# EAGLE design ATSAM_stepper_no_header_USART1 (EAGLE 9.1.0)
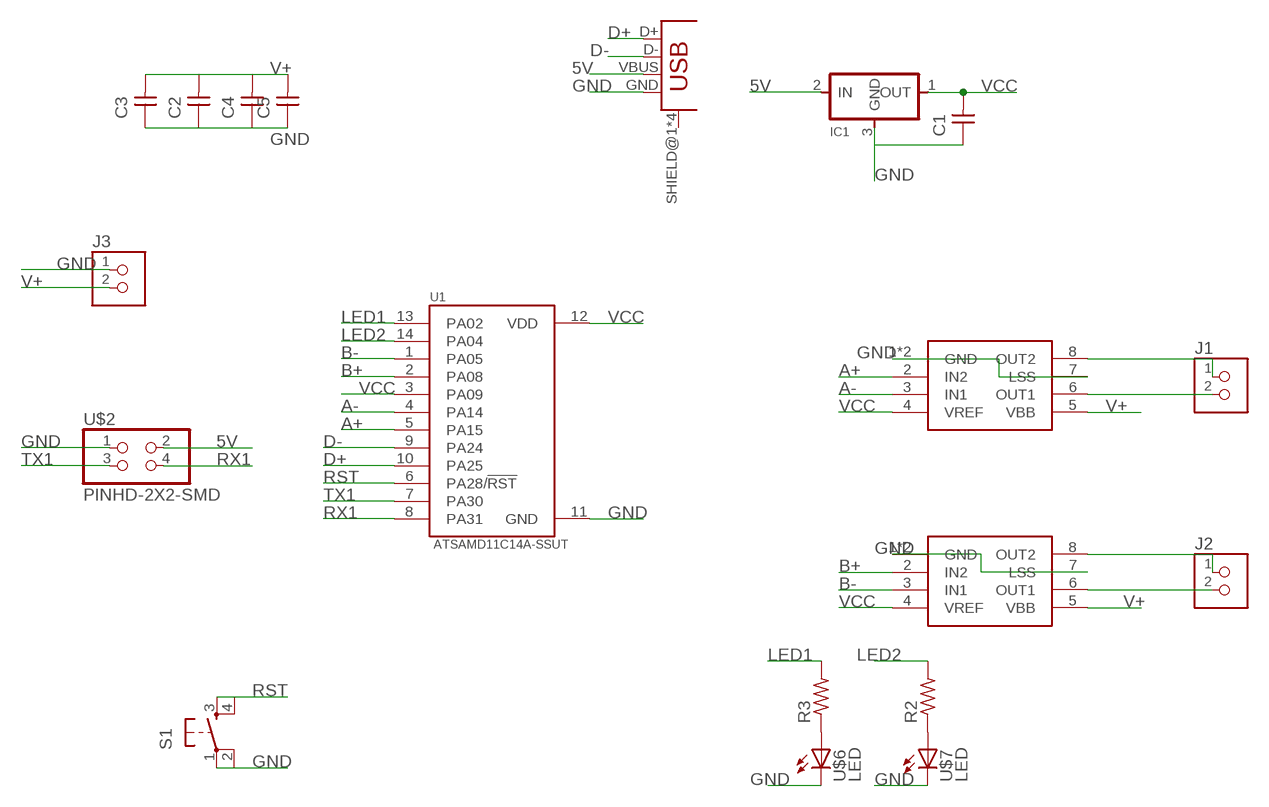
[diagram p0: schematic, sheet 1]

## Parts
C1  CAP-UNPOLARIZED  [C1206]
C2  CAP-UNPOLARIZED  [C1206]
C3  CAP-UNPOLARIZED  [C1206]
C4  CAP-UNPOLARIZED  [C1206]
C5  CAP-UNPOLARIZED  [C1206]
IC1  VR_REGULATOR-SOT23SOT23  [SOT23]
J1  TERM-1X02-FABLAB  [ED555DS-2DS]
J2  TERM-1X02-FABLAB  [ED555DS-2DS]
J3  TERM-1X02-FABLAB  [ED555DS-2DS]
R2  RES-US1206  [R1206]
R3  RES-US1206  [R1206]
S1  SW_SWITCH_TACTILE_6MM6MM_SWITCH  [6MM_SWITCH]
U1  ATSAMD11C14A-SSUT  [SOIC127P600X160-14N]
U$1  CONN_USB_MINIB  [USB_MINIB]
U$2  PINHD-2X2-SMD  [2X02SMD]
U$3  A4953-H-BRIDGE-MOTOR-DRIVER-PAD  [SOIC8_PAD]
U$4  A4953-H-BRIDGE-MOTOR-DRIVER-PAD  [SOIC8_PAD]
U$6  LED  [LED1206]
U$7  LED  [LED1206]

## Nets
5V: IC1.2(IN) U$1.VBUS U$2.2
A+: U1.5(PA15) U$3.2(IN2)
A-: U1.4(PA14) U$3.3(IN1)
B+: U1.2(PA08) U$4.2(IN2)
B-: U1.1(PA05) U$4.3(IN1)
D+: U1.10(PA25) U$1.D+
D-: U1.9(PA24) U$1.D-
GND: C1.1 C2.1 C3.1 C4.1 C5.1 IC1.3(GND) J3.1 S1.1(P) S1.2(P1) U1.11(GND) U$1.GND U$2.1 U$3.1(GND) U$3.7(LSS) U$3.GND U$4.1(GND) U$4.7(LSS) U$4.GND U$6.2(C) U$7.2(C)
LED1: R3.2 U1.13(PA02)
LED2: R2.2 U1.14(PA04)
N$5: R2.1 U$7.1(A)
N$12: J1.1 U$3.8(OUT2)
N$13: J1.2 U$3.6(OUT1)
N$14: J2.1 U$4.8(OUT2)
N$15: J2.2 U$4.6(OUT1)
N$16: R3.1 U$6.1(A)
RST: S1.3(S) S1.4(S1) U1.6(PA28/!RST)
RX1: U1.8(PA31) U$2.4
TX1: U1.7(PA30) U$2.3
V+: C2.2 C3.2 C4.2 C5.2 J3.2 U$3.5(VBB) U$4.5(VBB)
VCC: C1.2 IC1.1(OUT) U1.3(PA09) U1.12(VDD) U$3.4(VREF) U$4.4(VREF)
Unconnected: U$1.SHIELD@1(SHIELD) U$1.SHIELD@2(SHIELD) U$1.SHIELD@3(SHIELD) U$1.SHIELD@4(SHIELD)

## Library data of the parts
C1-C5 = fab:CAP-UNPOLARIZED
IC1 = fab:VR_REGULATOR-SOT23
J1-J3 = fab:TERM-1X02: 3.5mm terminal block, 2 positions ED555-2DS as found in the fablab inventory. Stolen from Adafruit <http://www.ladyada.net/library/pcb/eaglelibrary.html>, adapted by Zaerc.
R2 R3 = fab:RES-US: Resistor (US Symbol) Variants with postfix FAB are widened to allow the routing of internal traces
S1 = fab:SW_SWITCH_TACTILE_6MM: OMRON SWITCH
U1 = ATSAMD11C14A-SSUT:ATSAMD11C14A-SSUT: MCU 32-Bit SAM D11 ARM Cortex M0+ RISC 16KB Flash 1.8V/2.5V/3.3V 14-Pin SOIC T/R; AVAILABILITY: Unavailable; DESCRIPTION: Cortex-M0+, 16KB FLASH, 4KB SRAM, USB - 14 SOIC, INDUSTRIAL, GREEN, 1.6-3.6V, 48MHz/ SOIC .150 _SS_; MF: Microchip; MP: ATSAMD11C14A-SSUT; PACKAGE: SOIC-14 Microchip; PRICE: None
U$1 = fab:CONN_USB_MINIB
U$2 = fab:PINHD-2X2-SMD
U$3 U$4 = fab:A4953-H-BRIDGE-MOTOR-DRIVER-PAD
U$6 U$7 = fab:LED: LED

## Board
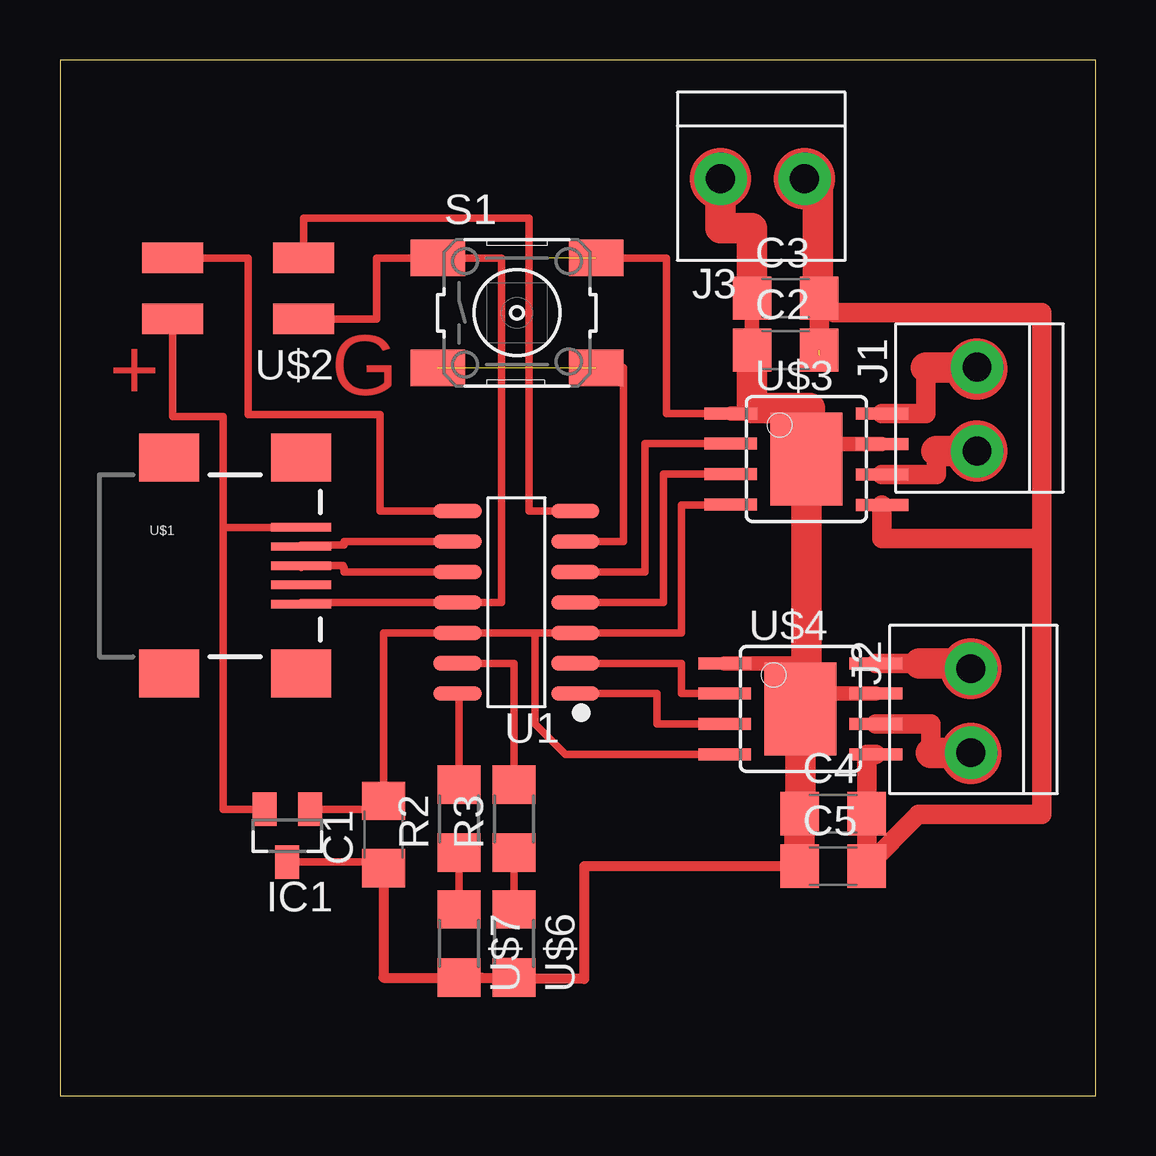
[diagram p1: board, top side]
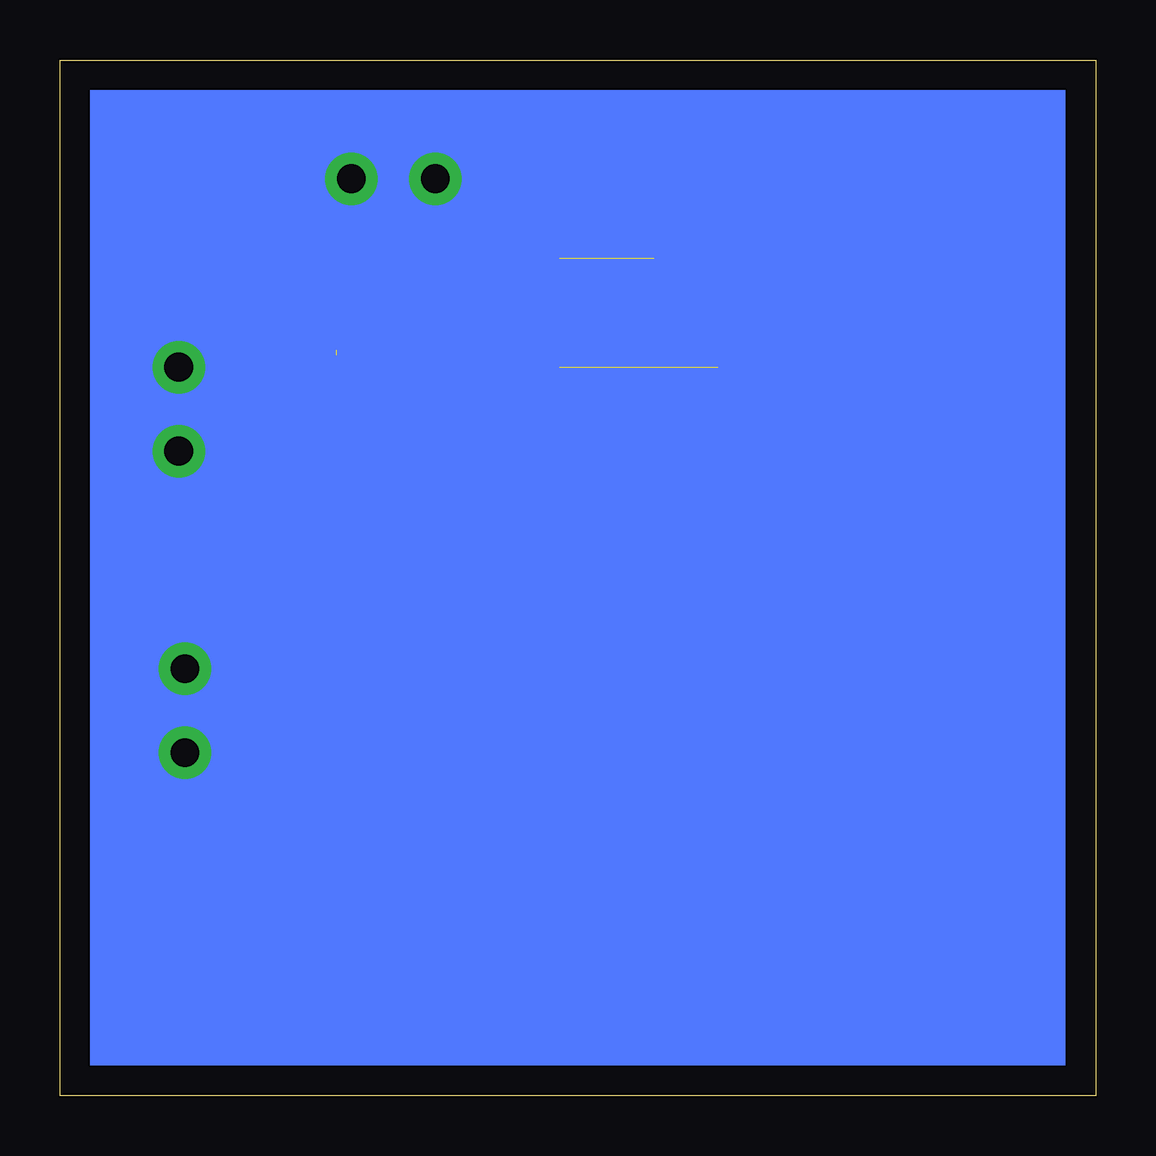
[diagram p2: board, bottom side, seen from below]

Size 43.18 x 43.18 mm. Coordinates in mm from the lower left corner, seen from the top.
Outline: 0,0 43.18,0 43.18,43.18 0,43.18 0,0
Copper layers (1*16): Top 0.035mm / dielectric 1.5mm / Bottom 0.035mm
Design rules "default *": minimum track width 10mil, minimum drill 24mil, track to track 16mil, track to pad 16mil, pad to pad 8mil, via to via 8mil, smd to smd 16mil, copper to edge 40mil, drill to drill 8mil, minimum pad ring 10mil, minimum via ring 8mil, stop-mask expansion 4mil, vias tented up to drill 0mil, thermal gap 10mil

### Footprints (pad centres in the part's own frame; a part is rotated, then mirrored left to right if it is on the bottom)
C1206 = smd 1.6 x 1.8: 1 -1.4,0; 2 1.4,0
SOT23 = smd 1 x 1.4: 1 -0.95,-1.1; 2 0.95,-1.1; 3 0,1.1
ED555DS-2DS = drill 1.2 pad 2.184: 1 1.8,0; 2 -1.7,0
R1206 = smd 1.6 x 1.803: 1 -1.422,0; 2 1.422,0
6MM_SWITCH = smd 2.286 x 1.524: 1 -3.302,2.286; 2 3.302,2.286; 3 -3.302,-2.286; 4 3.302,-2.286
SOIC127P600X160-14N = smd 2 x 0.6: 1 -2.45,3.81; 2 -2.45,2.54; 3 -2.45,1.27; 4 -2.45,0; 5 -2.45,-1.27; 6 -2.45,-2.54; 7 -2.45,-3.81; 8 2.45,-3.81; 9 2.45,-2.54; 10 2.45,-1.27; 11 2.45,0; 12 2.45,1.27; 13 2.45,2.54; 14 2.45,3.81
USB_MINIB = smd 2.5 x 0.35: D+ 3.77,0; D- 3.77,0.8; GND 3.77,-1.6; ID 3.77,-0.8; VBUS 3.77,1.6 | smd 2.5 x 2: SHIELD@1 -1.73,-4.5; SHIELD@2 -1.73,4.5; SHIELD@3 3.77,4.5; SHIELD@4 3.77,-4.5
2X02SMD = smd 2.54 x 1.27: 1 -2.54,1.27; 2 2.92,1.27; 3 -2.54,-1.27; 4 2.92,-1.27
SOIC8_PAD = smd 0.5 x 2.2: 1 -1.905,-3.154; 2 -0.645,-3.154; 3 0.625,-3.154; 4 1.895,-3.154; 5 1.905,3.154; 6 0.635,3.154; 7 -0.635,3.154; 8 -1.905,3.154 | smd 3.886 x 2.997: GND 0,0
LED1206 = smd 1.6 x 1.803: 1 -1.422,0; 2 1.422,0

### Placement (x,y rotation side)
C1  13.49,10.9 90 top
C2  30.25,31.09 0 top
C3  30.25,33.25 0 top
C4  32.23,11.76 0 top
C5  32.23,9.58 0 top
IC1  9.47,10.85 180 top
J1  38.23,28.57 90 top
J2  37.97,16 90 top
J3  29.34,38.23 180 top
R2  16.64,11.56 90 top
R3  18.92,11.56 90 top
S1  19.05,32.64 0 top
U1  19.02,20.57 180 top
U$1  6.27,22.1 0 top
U$2  7.62,33.66 180 top
U$3  31.11,26.54 270 top
U$4  30.86,16.13 270 top
U$6  18.92,6.35 270 top
U$7  16.64,6.35 270 top

### Tracks (layer width: path | path; a pad name or v marks a point on that pad's centre or on a via)
5V
  Top 0.305: 8.56,11.95 IC1.2 6.81,11.95 6.81,23.67 6.81,23.7 | 6.81,23.7 6.81,28.32 4.7,28.32 U$2.2 | U$1.VBUS 6.81,23.7
A+
  Top 0.305: U1.5 24.38,21.84 24.38,27.19 U$3.2
A-
  Top 0.305: U1.4 25.15,20.57 25.15,25.92 U$3.3
B+
  Top 0.305: U1.2 25.91,18.03 25.91,16.76 U$4.2
B-
  Top 0.305: U1.1 24.89,16.76 24.89,15.49 U$4.3
D+
  Top 0.305: U$1.D+ 10.04,22.03 U$1.D+ | U1.10 11.85,21.84 11.85,22.03 11.81,22.03 11.81,22.1 U$1.D+
D-
  Top 0.305: 10.04,22.96 U$1.D- 10.04,22.96 | U1.9 11.85,23.11 11.85,22.96 10.04,22.96
GND  (1 unrouted)
  Top 0.305: 13.97,20.57 U1.11 18.41,20.57 18.41,34.92 S1.1 13.21,34.92 13.21,32.38 U$2.1 | 13.97,20.57 11.85,20.57 11.85,20.56 10.04,20.56 U$1.GND | 14.05,20.57 13.97,20.57 | IC1.3 13.49,9.75 C1.1 | S1.2 25.27,34.92 25.27,28.45 U$3.1
  Top 0.406: C5.1 21.84,9.58 21.84,4.88 18.34,4.88 18.34,5.56 18.92,5.56 U$6.2 17.58,4.93 | U$7.2 17.58,4.93 | C1.1 13.49,4.93 17.58,4.93 | IC1.3 9.47,9.88
  Top 0.61: C3.1 C2.1 | U$3.1 28.57,28.45 31.27,28.45 31.27,28.68 | U$4.1 30.86,18.03 30.86,16.82 | 30.86,16.82 U$4.GND | U$3.7 31.27,27.18 31.27,26.54 | U$4.7 30.86,16.76 30.86,16.82
  Top 1.27: C3.1 28.85,36.17 27.54,36.17 J3.1 | C2.1 28.85,28.68 31.27,28.68 31.27,26.54 U$3.GND 31.11,16.13 U$4.GND 30.86,11.76 C4.1 C5.1
LED1
  Top 0.305: U1.13 18.92,18.03 R3.2
LED2
  Top 0.305: U1.14 16.64,16.76 R2.2
N$5
  Top 0.305: R2.1 U$7.1
N$12
  Top 0.813: U$3.8 36.09,28.45 36.09,30.35
  Top 1.27: 36.09,30.35 38.2,30.35 J1.1
N$13
  Top 0.813: 36.52,26.88 36.52,25.91 U$3.6
  Top 1.27: J1.2 36.52,26.88
N$14
  Top 0.813: J2.1 37.97,18.03 | 35.81,18.03 U$4.8
  Top 1.27: 37.97,18.03 35.81,18.03
N$15
  Top 0.813: 36.3,14.3 36.3,15.11 36.3,15.49 U$4.6 | 36.3,14.3
  Top 1.27: J2.2 36.3,14.3
N$16
  Top 0.305: R3.1 U$6.1
RST  (1 unrouted)
  Top 0.305: 21.48,22.99 U1.6 23.5,23.11 23.5,30.35 S1.4
RX1
  Top 0.305: U$2.4 7.85,34.92 7.85,28.4 13.34,28.4 13.34,24.38 U1.8
TX1
  Top 0.305: 20.57,24.38 U1.7 19.56,24.38 19.56,36.58 10.16,36.58 U$2.3
V+  (1 unrouted)
  Top 0.813: 31.95,30.89 31.65,30.89 C3.2 32.26,32.64 40.92,32.64 40.92,23.24 | 40.92,23.24 40.92,11.73 35.79,11.73 C5.2 C4.2 33.63,14.22 U$4.5 | U$3.5 34.27,23.24 40.92,23.24
  Top 1.27: J3.2 31.6,37.67 31.6,33.3 C3.2
VCC
  Top 0.305: U1.3 23.11,19.3 | 23.11,19.3 25.91,19.3 25.91,24.64 27.96,24.64 U$3.4 | 19.68,19.3 19.81,19.3 | 19.81,19.3 21.97,19.3 | 21.97,19.3 23.11,19.3 | 19.81,19.3 U1.12 13.49,19.3 C1.2 13.14,11.95 IC1.1 10.42,11.99 | 19.81,19.3 21.97,19.3 | 19.81,19.3 19.81,15.49 21.08,14.22 27.7,14.22 U$4.4
(copper drawn outside any net)
  shapes: Bottom area x1, Top circle x6

### Text on the board
Top: + | G